# Altium schematic sheet LPDA_2_SMA.SchDoc
size A4
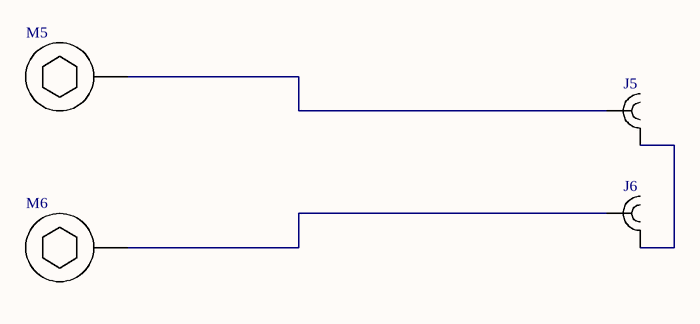
[diagram p0: LPDA_2_SMA.SchDoc]

## Parts
J5  CONSMA001-G  [SMA TH Vertical Linx CONSMA001-G]  (value not drawn)
J6  CONSMA001-G  [SMA TH Vertical Linx CONSMA001-G]  (value not drawn)
M5  (no value)  [Screw Hex Socket M2.5X4 Connected]
M6  (no value)  [Screw Hex Socket M2.5X4 Connected]

## Nets
NetJ5_1: J5.1 M5.1
NetJ5_2: J5.2 J6.2
NetJ6_1: J6.1 M6.1

## Library data of the parts
J5 J6 = SMA TH VERTICAL LINX CONSMA001-G: Value: CONSMA001-G
M5 M6 = Screw Hex Socket Connected: Screw Hex Socket Connected BN610